# Altium schematic sheet ws2812b.SchDoc: WS2812B
size Letter; Author: Lin Fu; SheetNumber: 1; SheetTotal: 3; ENG_APP_DATE: --/--/--; DSN_APP_DATE: --/--/--; CHK_APP_DATE: --/--/--
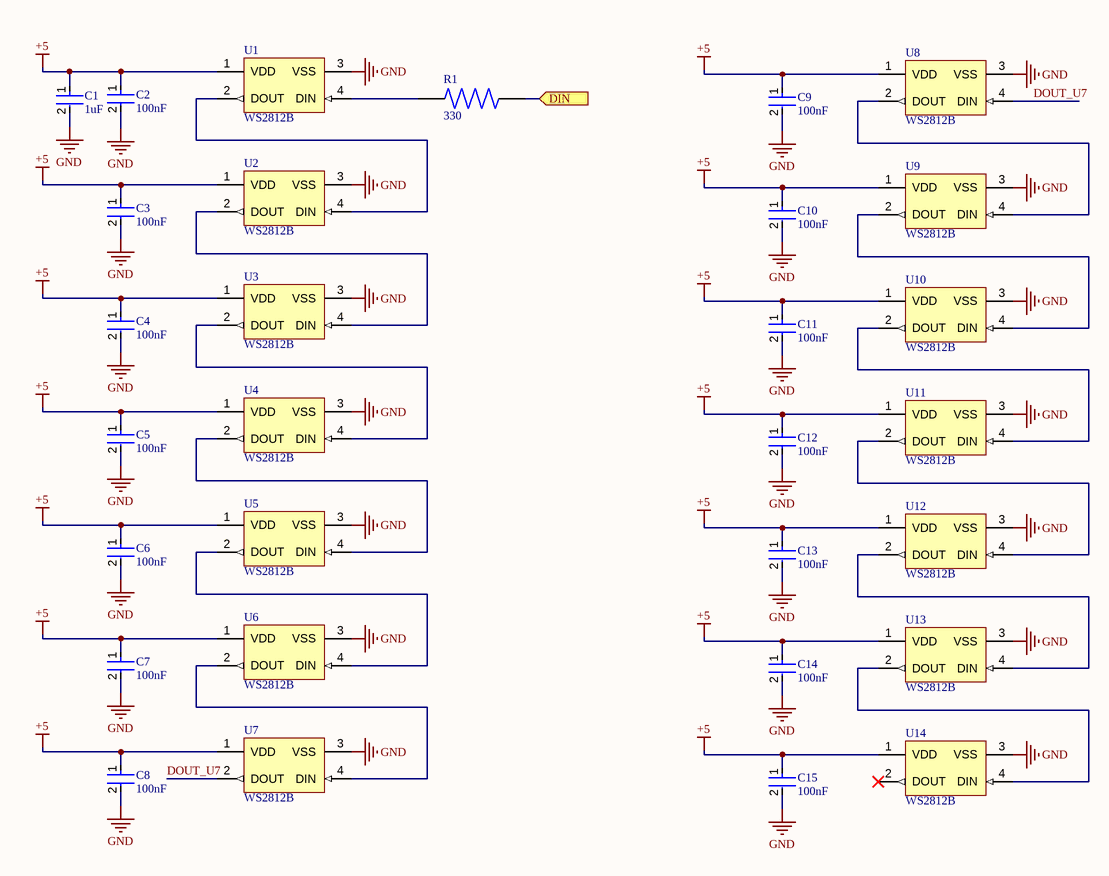
[diagram p0: ws2812b.SchDoc]

## Parts
C1  1uF  [FP-CGA3E-0_3-0_1-IPC_A]
C2  100nF  [FP-CL10-IPC_A]
C3  100nF  [FP-CL10-IPC_A]
C4  100nF  [FP-CL10-IPC_A]
C5  100nF  [FP-CL10-IPC_A]
C6  100nF  [FP-CL10-IPC_A]
C7  100nF  [FP-CL10-IPC_A]
C8  100nF  [FP-CL10-IPC_A]
C9  100nF  [FP-CL10-IPC_A]
C10  100nF  [FP-CL10-IPC_A]
C11  100nF  [FP-CL10-IPC_A]
C12  100nF  [FP-CL10-IPC_A]
C13  100nF  [FP-CL10-IPC_A]
C14  100nF  [FP-CL10-IPC_A]
C15  100nF  [FP-CL10-IPC_A]
R1  value 330  [RES_ERJ-PB3B3300V]  (hidden comment: ERJ-PB3B3300V)
U1  WS2812B  [ADAI-WS2812B_V]
U2  WS2812B  [ADAI-WS2812B_V]
U3  WS2812B  [ADAI-WS2812B_V]
U4  WS2812B  [ADAI-WS2812B_V]
U5  WS2812B  [ADAI-WS2812B_V]
U6  WS2812B  [ADAI-WS2812B_V]
U7  WS2812B  [ADAI-WS2812B_V]
U8  WS2812B  [ADAI-WS2812B_V]
U9  WS2812B  [ADAI-WS2812B_V]
U10  WS2812B  [ADAI-WS2812B_V]
U11  WS2812B  [ADAI-WS2812B_V]
U12  WS2812B  [ADAI-WS2812B_V]
U13  WS2812B  [ADAI-WS2812B_V]
U14  WS2812B  [ADAI-WS2812B_V]

## Ports
DIN (in)

## Nets
+5: C1.1 C2.1 C3.1 C4.1 C5.1 C6.1 C7.1 C8.1 C9.1 C10.1 C11.1 C12.1 C13.1 C14.1 C15.1 U1.1(VDD) U2.1(VDD) U3.1(VDD) U4.1(VDD) U5.1(VDD) U6.1(VDD) U7.1(VDD) U8.1(VDD) U9.1(VDD) U10.1(VDD) U11.1(VDD) U12.1(VDD) U13.1(VDD) U14.1(VDD)
GND: C1.2 C2.2 C3.2 C4.2 C5.2 C6.2 C7.2 C8.2 C9.2 C10.2 C11.2 C12.2 C13.2 C14.2 C15.2 U1.3(VSS) U2.3(VSS) U3.3(VSS) U4.3(VSS) U5.3(VSS) U6.3(VSS) U7.3(VSS) U8.3(VSS) U9.3(VSS) U10.3(VSS) U11.3(VSS) U12.3(VSS) U13.3(VSS) U14.3(VSS)
DIN: R1.2 ; port DIN
DOUT_U7: U7.2(DOUT) U8.4(DIN)
NetR1_1: R1.1 U1.4(DIN)
NetU1_2: U1.2(DOUT) U2.4(DIN)
NetU2_2: U2.2(DOUT) U3.4(DIN)
NetU3_2: U3.2(DOUT) U4.4(DIN)
NetU4_2: U4.2(DOUT) U5.4(DIN)
NetU5_2: U5.2(DOUT) U6.4(DIN)
NetU6_2: U6.2(DOUT) U7.4(DIN)
NetU8_2: U8.2(DOUT) U9.4(DIN)
NetU9_2: U9.2(DOUT) U10.4(DIN)
NetU10_2: U10.2(DOUT) U11.4(DIN)
NetU11_2: U11.2(DOUT) U12.4(DIN)
NetU12_2: U12.2(DOUT) U13.4(DIN)
NetU13_2: U13.2(DOUT) U14.4(DIN)

Not connected (* = marked no-connect by the designer): U14 2(DOUT)*

## Notes on the sheet
- DWG. NO.
- REV.
- SHT.
- THIS DOCUMENT AND THE DATA DISCLOSED HEREIN OR HEREWITH IS THE PROPERTY OF ALTIUM LIMITED AND MAY BE FREELY DISTRIBUTED IN WHOLE. NO RIGHTS ARE RESERVED OR EXPRESS OR IMPLIED WARANTEE GIVEN.
- REVISION
- DESCRIPTION
- DATE
- APPROVED
- ENG:
- APPROVALS
- PROJECT
- DSN:
- CHK:
- REFERENCE DOCUMENTS
- PROJECT REVISION:
- TITLE
- DOCUMENT REVISION:
- DESIGN ITEM:
- BOM:
- FAB DWG:
- PCB DWG:
- ASSY DWG:
- SCALE:
- SIZE
- B
- CAGE CODE
- FILE NAME
- DWG NO.
- SHEET
- OF
- REV

## Library data of the parts
C1 = CMP-08246-002161-1: Cap Ceramic 1uF 16V X7R 10% Pad SMD 0603 +125°C Automotive T/R; Capacitance: 1uF; Package Quantity: 4000; Voltage Rating (DC): 16V; Voltage Rating: 16V; Max Operating Temperature: 125°C; Mount: Surface Mount; Length: 0.063inch; Width: 0.8mm; Weight: 7.1E-05oz; Lead Free: Lead Free; Thickness: 0.035inch; Case/Package: 0603; REACH SVHC: No SVHC; Tolerance: 10%; Min Operating Temperature: -55°C; Termination: SMD/SMT; Case Code (Imperial): 0603; Height: 0.8mm; Case Code (Metric): 1608; Packaging: Tape and Reel; Ratings: AEC-Q200; Dielectric: X7R
C2-C15 = CMP-13271-002683-1: Cap Ceramic 100nF 16V X7R ±10% Pad SMD 0603 +125°C T/R; Voltage Rating: 16V; Max Operating Temperature: 125°C; Capacitance: 100nF; Features: Soft Termination; Length: 0.063inch; Packaging: Tape and Reel; Min Operating Temperature: -55°C; Mount: Surface Mount; Case/Package: 0603; Case Code (Metric): 1608; Width: 0.031inch; Ratings: AEC-Q200; Thickness: 0.035inch; Case Code (Imperial): 0603; Tolerance: 10%
R1 = CMP-009-00177-1: Series/Type: High Precision Thick Film Chip Resistors , Power Rating (W): 0.2, Chip Size (LxW(EIA)) (mm): 1.6 x 0.8 (EIA:0603), Resistance Values (鈩; MF: Panasonic; Availability: In Stock; MP: ERJ-PB3B3300V; Component Type: Standard; Purchase-URL: https://pricing.snapeda.com/search/part/ERJ-PB3B3300V/?ref=eda; Source: ERJ-PB3B3300V.SchLib; Design Item ID: ERJ-PB3B3300V; Pins: 2; SnapEDA_Link: https://www.snapeda.com/parts/ERJ-PB3B3300V/Panasonic/view-part/?ref=snap; Price: None; Case/Package: 603-2 Panasonic; Check_prices: https://www.snapeda.com/parts/ERJ-PB3B3300V/Panasonic/view-part/?ref=eda
U1-U14 = CMP-007-00035-2: Intelligent Control LED Integrated Light Source, 3.5 to 5.3 V, -25 to 80 degC, 4-Pin SMD, RoHS, Bulk; Manufacturer: Adafruit Industries; Datasheet URL: https://cdn-shop.adafruit.com/datasheets/WS2812B.pdf; Manufacturer URL: https://www.adafruit.com/; Datasheet Version: May-13; Case/Package: WS2812B; Mounting Technology: SM; RoHS Compliant: False; Package Description: 4-Pin Surface Mount Device, Body 5 x 5 mm, Pitch 3.3 mm; Package Reference: WS2812B